# Altium project kursach.PrjPcb
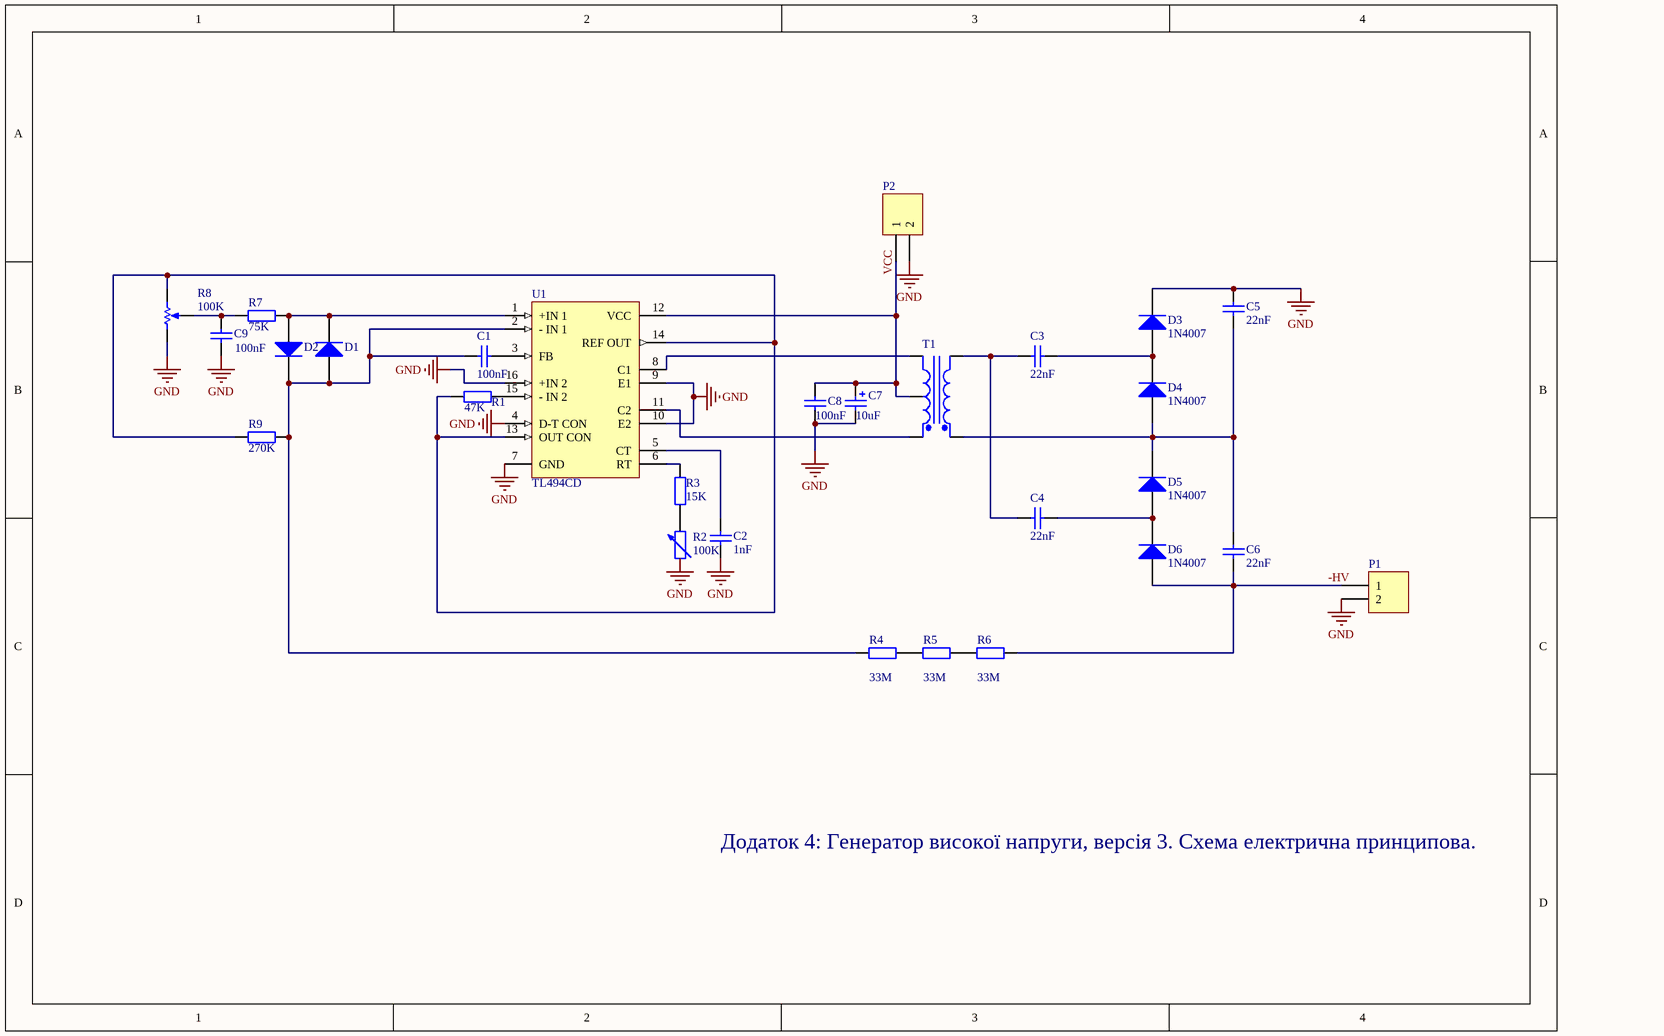
[diagram p0: dod1.SchDoc]
2 sheets, 58 parts. Net scope: global (net labels, ports and power ports of the same name join across sheets).
Sheets:
  dod1.SchDoc
  dod2.SchDoc

## Sheet dod1.SchDoc
size A4

### Parts
(Parts that share a designator on the sheet are numbered #1, #2 ... from top to bottom, then left to right.)
C1#1  value 100nF  [RAD-0.3]  (hidden comment: Cap)
C2#1  value 1nF  [RAD-0.3]  (hidden comment: Cap)
C3#1  value 22nF  [RAD-0.3]  (hidden comment: Cap)
C4#1  value 22nF  [RAD-0.3]  (hidden comment: Cap)
C5#1  value 22nF  [RAD-0.3]  (hidden comment: Cap)
C6#1  value 22nF  [RAD-0.3]  (hidden comment: Cap)
C7#1  value 10uF  [POLAR0.8]  (hidden comment: Cap Pol2)
C8  value 100nF  [RAD-0.3]  (hidden comment: Cap)
C9  value 100nF  [RAD-0.3]  (hidden comment: Cap)
D1#1  Diode 1N914  [DO-35]  (value not drawn)
D2#1  Diode 1N914  [DO-35]  (value not drawn)
D3#1  1N4007  [DO-41]
D4#1  1N4007  [DO-41]
D5  1N4007  [DO-41]
D6  1N4007  [DO-41]
P1#1  Header 2  [HDR1X2]  (value not drawn)
P2#1  Header 2  [HDR1X2]  (value not drawn)
R1#1  value 47K  [AXIAL-0.4]  (hidden comment: Res2)
R2#1  value 100K  [AXIAL-0.6]  (hidden comment: Res Adj2)
R3#1  value 15K  [AXIAL-0.4]  (hidden comment: Res2)
R4  value 33M  [AXIAL-0.4]  (hidden comment: Res2)
R5#1  value 33M  [AXIAL-0.4]  (hidden comment: Res2)
R6#1  value 33M  [AXIAL-0.4]  (hidden comment: Res2)
R7#1  value 75K  [AXIAL-0.4]  (hidden comment: Res2)
R8#1  value 100K  [VR5]  (hidden comment: RPot)
R9#1  value 270K  [AXIAL-0.4]  (hidden comment: Res2)
T1#1  Trans CT  [TRF_5]  (value not drawn)
U1#1  TL494CD  [D016_N]

### Nets
GND: C2#1.2 C5#1.2 C7#1.2 C8.2 C9.1 D3#1.2(K) P1#1.2 P2#1.2 R8#1.1(TOP) U1#1.4(D-T_CON) U1#1.7(GND) U1#1.9(E1) U1#1.10(E2) U1#1.16(+IN_2)
-HV: C6#1.1 D6.1(A) P1#1.1 R6#1.2
VCC: C7#1.1 C8.1 P2#1.1 T1#1.4(SecCT) U1#1.12(VCC)
NetC1#1_1: C1#1.1 D1#1.1(A) D2#1.2(K) R4.1 R9#1.2 U1#1.2(-_IN_1)
NetC1#1_2: C1#1.2 U1#1.3(FB)
NetC2#1_1: C2#1.1 U1#1.5(CT)
NetC3#1_1: C3#1.1 C4#1.1 T1#1.2(Pri-)
NetC3#1_2: C3#1.2 D3#1.1(A) D4#1.2(K)
NetC4#1_2: C4#1.2 D5.1(A) D6.2(K)
NetC5#1_1: C5#1.1 C6#1.2 D4#1.1(A) D5.2(K) T1#1.1(Pri+)
NetC9_2: C9.2 R7#1.1 R8#1.3(TAP)
NetD1#1_2: D1#1.2(K) D2#1.1(A) R7#1.2 U1#1.1(+IN_1)
NetR1#1_1: R1#1.1 R8#1.2(BOT) R9#1.1 U1#1.13(OUT_CON) U1#1.14(REF_OUT)
NetR1#1_2: R1#1.2 U1#1.15(-_IN_2)
NetR2#1_2: R2#1.2 R3#1.1
NetR3#1_2: R3#1.2 U1#1.6(RT)
NetR4_2: R4.2 R5#1.1
NetR5#1_2: R5#1.2 R6#1.1
NetT1#1_3: T1#1.3(Sec+) U1#1.11(C2)
NetT1#1_5: T1#1.5(Sec-) U1#1.8(C1)

Not connected (* = marked no-connect by the designer): R2#1 1

### Notes on the sheet
- Додаток 4: Генератор високої напруги, версія 3. Схема електрична принципова.
- Labels drawn without touching a wire or pin: GND

### Library data of the parts
C1#1 C2#1 C3#1 C4#1 C5#1 C6#1 C8 C9 = Cap: Capacitor; Published: 8-Jun-2000; LatestRevisionDate: 17-Jul-2002; LatestRevisionNote: Re-released for DXP Platform.; PackageReference: RAD-0.3; Publisher: Altium Limited; PackageDescription: Radial Cap, Thru-Hole; 2 Leads; 0.3 in Pin Spacing
C7#1 = Cap Pol2: Polarized Capacitor (Axial); Published: 8-Jun-2000; LatestRevisionDate: 17-Jul-2002; LatestRevisionNote: Re-released for DXP Platform.; PackageReference: POLAR0.8; Publisher: Altium Limited; PackageDescription: Polarized Capacitor; 2 Leads
D1#1 D2#1 = Diode 1N914: High Conductance Fast Diode; Published: 8-Jun-2000; LatestRevisionDate: 17-Jul-2002; LatestRevisionNote: Re-released for DXP Platform.; DatasheetVersion: 1997; PackageReference: DO-35; Publisher: Altium Limited; PackageDescription: Diode, Axial; Body 3.8 x 1.9 mm (LxDia. max), Lead Dia. 0.53 mm (max); Code_JEDEC: DO-204-AH; ComponentLink1Description: Manufacturer Link; ComponentLink1URL: http://www.fairchildsemi.com/; ComponentLink2Description: Datasheet; ComponentLink2URL: http://www.fairchildsemi.com/ds/1N%2F1N4448.pdf
D3#1 D4#1 D5 D6 = Diode 1N4007: 1 Amp General Purpose Rectifier; Published: 8-Jun-2000; LatestRevisionDate: 17-Jul-2002; LatestRevisionNote: Re-released for DXP Platform.; DatasheetVersion: 1998; PackageVersion: Aug-1999; PackageReference: DO-41; Publisher: Altium Limited; PackageDescription: Diode, Axial; Body 5.2 x 2.7 mm (LxDia. max), Lead Dia. 0.86 mm (max); Code_JEDEC: DO-204-AL; ComponentLink1Description: Manufacturer Link; ComponentLink1URL: http://www.fairchildsemi.com/; ComponentLink2Description: Datasheet; ComponentLink2URL: http://www.fairchildsemi.com/ds/1N%2F1N4001.pdf
P1#1 P2#1 = Header 2: Header, 2-Pin; LatestRevisionDate: 17-Jul-2002; LatestRevisionNote: Re-released for DXP Platform.; Publisher: Altium Limited
R1#1 R3#1 R4 R5#1 R6#1 R7#1 R9#1 = Res2: Resistor; Published: 8-Jun-2000; LatestRevisionDate: 17-Jul-2002; LatestRevisionNote: Re-released for DXP Platform.; PackageReference: AXIAL-0.4; Publisher: Altium Limited; PackageDescription: Axial Device, Thru-Hole; 2 Leads; 0.4 in Pin Spacing
R2#1 = Res Adj2: Variable Resistor; Set Position: 0.5; Published: 8-Jun-2000; LatestRevisionDate: 17-Jul-2002; LatestRevisionNote: Re-released for DXP Platform.; PackageReference: AXIAL-0.6; Publisher: Altium Limited; PackageDescription: Axial Device, Thru-Hole; 2 Leads; 0.6 in Pin Spacing
R8#1 = RPot: Potentiometer; Sim Note: Enter the Resistance value and the set point into parameter fields.; Set Position: 0.5; Published: 8-Jun-2000; LatestRevisionDate: 17-Jul-2002; LatestRevisionNote: Re-released for DXP Platform.; PackageReference: VR5; Publisher: Altium Limited; PackageDescription: Variable Resistor, Thru-Hole; 3 Leads
T1#1 = Trans CT: Center-Tapped Transformer (Coupled Inductor Model); Published: 8-Jun-2000; LatestRevisionDate: 17-Jul-2002; LatestRevisionNote: Re-released for DXP Platform.; PackageReference: TRF_5; Publisher: Altium Limited; PackageDescription: Transformer; 5 Leads
U1#1 = TL494CD: Pulse-Width-Modulation Control Circuit; Published: 15-Apr-2002; LatestRevisionDate: 13-Apr-2006; LatestRevisionNote: IPC-7351 Footprint Added.; DatasheetVersion: Oct-1988; PackageVersion: Jan-1998; PackageReference: D016; Publisher: Altium Limited; PackageDescription: 16-Pin Small Outline Integrated Circuit 1.27 mm Pitch; Code_IPC: SOIC127P600-16; ComponentLink1Description: Manufacturer Link; ComponentLink1URL: http://www.ti.com/

## Sheet dod2.SchDoc
size A4
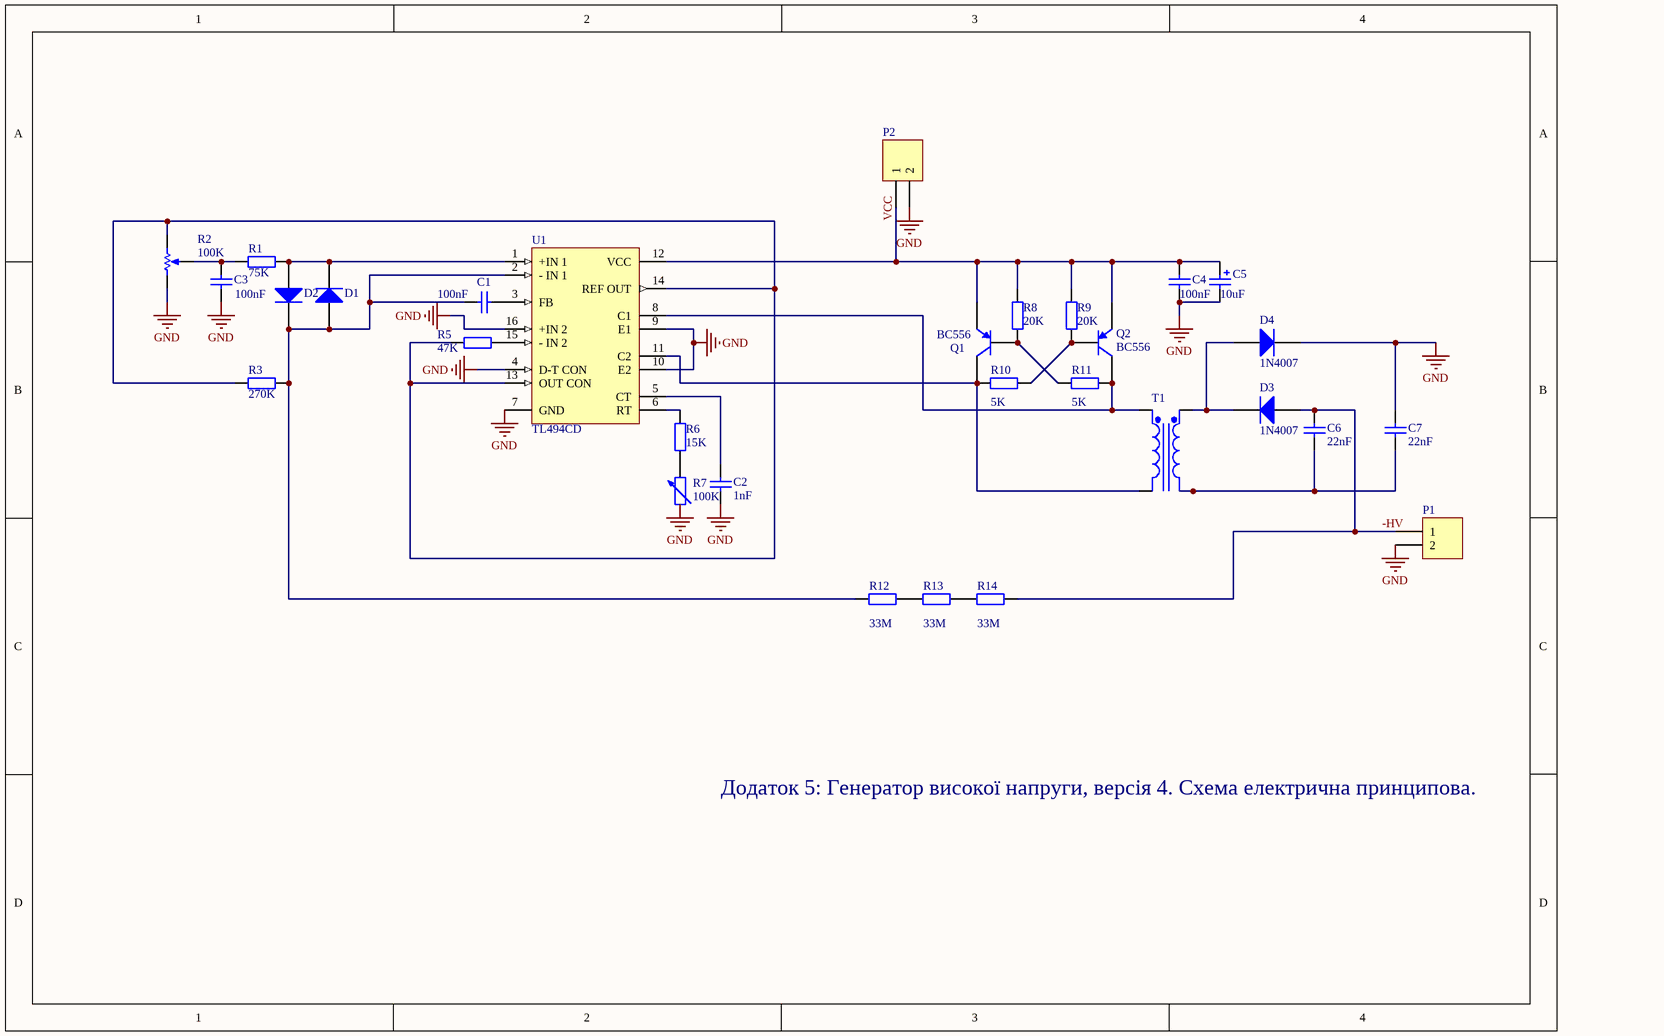
[diagram p1: dod2.SchDoc]

### Parts
(Parts that share a designator on the sheet are numbered #1, #2 ... from top to bottom, then left to right.)
C1#2  value 100nF  [RAD-0.3]  (hidden comment: Cap)
C2#2  value 1nF  [RAD-0.3]  (hidden comment: Cap)
C3#2  value 100nF  [RAD-0.3]  (hidden comment: Cap)
C4#2  value 100nF  [RAD-0.3]  (hidden comment: Cap)
C5#2  value 10uF  [POLAR0.8]  (hidden comment: Cap Pol2)
C6#2  value 22nF  [RAD-0.3]  (hidden comment: Cap)
C7#2  value 22nF  [RAD-0.3]  (hidden comment: Cap)
D1#2  Diode 1N914  [DO-35]  (value not drawn)
D2#2  Diode 1N914  [DO-35]  (value not drawn)
D3#2  1N4007  [DO-41]
D4#2  1N4007  [DO-41]
P1#2  Header 2  [HDR1X2]  (value not drawn)
P2#2  Header 2  [HDR1X2]  (value not drawn)
Q1  BC556  [TO-92A]
Q2  BC556  [TO-92A]
R1#2  value 75K  [AXIAL-0.4]  (hidden comment: Res2)
R2#2  value 100K  [VR5]  (hidden comment: RPot)
R3#2  value 270K  [AXIAL-0.4]  (hidden comment: Res2)
R5#2  value 47K  [AXIAL-0.4]  (hidden comment: Res2)
R6#2  value 15K  [AXIAL-0.4]  (hidden comment: Res2)
R7#2  value 100K  [AXIAL-0.6]  (hidden comment: Res Adj2)
R8#2  value 20K  [AXIAL-0.4]  (hidden comment: Res2)
R9#2  value 20K  [AXIAL-0.4]  (hidden comment: Res2)
R10  value 5K  [AXIAL-0.4]  (hidden comment: Res2)
R11  value 5K  [AXIAL-0.4]  (hidden comment: Res2)
R12  value 33M  [AXIAL-0.4]  (hidden comment: Res2)
R13  value 33M  [AXIAL-0.4]  (hidden comment: Res2)
R14  value 33M  [AXIAL-0.4]  (hidden comment: Res2)
T1#2  Trans Cupl  [TRF_4]  (value not drawn)
U1#2  TL494CD  [D016_N]

### Nets
GND: C2#2.2 C3#2.1 C4#2.2 C5#2.2 C7#2.2 D4#2.2(K) P1#2.2 P2#2.2 R2#2.1(TOP) U1#2.4(D-T_CON) U1#2.7(GND) U1#2.9(E1) U1#2.10(E2) U1#2.16(+IN_2)
-HV: C6#2.2 D3#2.1(A) P1#2.1 R14.2
VCC: C4#2.1 C5#2.1 P2#2.1 Q1.1(E) Q2.1(E) R8#2.2 R9#2.2 U1#2.12(VCC)
NetC1#2_1: C1#2.1 D1#2.1(A) D2#2.2(K) R3#2.2 R12.1 U1#2.2(-_IN_1)
NetC1#2_2: C1#2.2 U1#2.3(FB)
NetC2#2_1: C2#2.1 U1#2.5(CT)
NetC3#2_2: C3#2.2 R1#2.1 R2#2.3(TAP)
NetC6#2_1: C6#2.1 C7#2.1 T1#2.4(Sec-)
NetD1#2_2: D1#2.2(K) D2#2.1(A) R1#2.2 U1#2.1(+IN_1)
NetD3#2_2: D3#2.2(K) D4#2.1(A) T1#2.3(Sec+)
NetQ1_2: Q1.2(B) R8#2.1 R11.1
NetQ1_3: Q1.3(C) R10.1 T1#2.2(Pri-) U1#2.11(C2)
NetQ2_2: Q2.2(B) R9#2.1 R10.2
NetQ2_3: Q2.3(C) R11.2 T1#2.1(Pri+) U1#2.8(C1)
NetR2#2_2: R2#2.2(BOT) R3#2.1 R5#2.1 U1#2.13(OUT_CON) U1#2.14(REF_OUT)
NetR5#2_2: R5#2.2 U1#2.15(-_IN_2)
NetR6#2_1: R6#2.1 R7#2.2
NetR6#2_2: R6#2.2 U1#2.6(RT)
NetR12_2: R12.2 R13.1
NetR13_2: R13.2 R14.1

Not connected (* = marked no-connect by the designer): R7#2 1

### Notes on the sheet
- Додаток 5: Генератор високої напруги, версія 4. Схема електрична принципова.
- Labels drawn without touching a wire or pin: GND

### Library data of the parts
C1#2 C2#2 C3#2 C4#2 C6#2 C7#2 = Cap: Capacitor; Published: 8-Jun-2000; LatestRevisionDate: 17-Jul-2002; LatestRevisionNote: Re-released for DXP Platform.; PackageReference: RAD-0.3; Publisher: Altium Limited; PackageDescription: Radial Cap, Thru-Hole; 2 Leads; 0.3 in Pin Spacing
C5#2 = Cap Pol2: Polarized Capacitor (Axial); Published: 8-Jun-2000; LatestRevisionDate: 17-Jul-2002; LatestRevisionNote: Re-released for DXP Platform.; PackageReference: POLAR0.8; Publisher: Altium Limited; PackageDescription: Polarized Capacitor; 2 Leads
D1#2 D2#2 = Diode 1N914: High Conductance Fast Diode; Published: 8-Jun-2000; LatestRevisionDate: 17-Jul-2002; LatestRevisionNote: Re-released for DXP Platform.; DatasheetVersion: 1997; PackageReference: DO-35; Publisher: Altium Limited; PackageDescription: Diode, Axial; Body 3.8 x 1.9 mm (LxDia. max), Lead Dia. 0.53 mm (max); Code_JEDEC: DO-204-AH; ComponentLink1Description: Manufacturer Link; ComponentLink1URL: http://www.fairchildsemi.com/; ComponentLink2Description: Datasheet; ComponentLink2URL: http://www.fairchildsemi.com/ds/1N%2F1N4448.pdf
D3#2 D4#2 = Diode 1N4007: 1 Amp General Purpose Rectifier; Published: 8-Jun-2000; LatestRevisionDate: 17-Jul-2002; LatestRevisionNote: Re-released for DXP Platform.; DatasheetVersion: 1998; PackageVersion: Aug-1999; PackageReference: DO-41; Publisher: Altium Limited; PackageDescription: Diode, Axial; Body 5.2 x 2.7 mm (LxDia. max), Lead Dia. 0.86 mm (max); Code_JEDEC: DO-204-AL; ComponentLink1Description: Manufacturer Link; ComponentLink1URL: http://www.fairchildsemi.com/; ComponentLink2Description: Datasheet; ComponentLink2URL: http://www.fairchildsemi.com/ds/1N%2F1N4001.pdf
P1#2 P2#2 = Header 2: Header, 2-Pin; LatestRevisionDate: 17-Jul-2002; LatestRevisionNote: Re-released for DXP Platform.; Publisher: Altium Limited
Q1 Q2 = 2N3906: PNP General Purpose Amplifier; Published: 8-Jun-2000; LatestRevisionDate: 15-Jan-2003; LatestRevisionNote: PCB Footprint 'BCY-W3/D4.7' replaced; DatasheetVersion: 1997; PackageVersion: Sep-1998; PackageReference: TO-92A; Publisher: Altium Limited; PackageDescription: TO, Flat Index; 3 In-Line, Axial Leads; Body Dia. 4.5mm; Leads 0.51 x 0.48 mm (max); ComponentLink1Description: Manufacturer Link; ComponentLink1URL: http://www.fairchildsemi.com/; ComponentLink2Description: Datasheet; ComponentLink2URL: http://www.fairchildsemi.com/ds/2N%2F2N3906.pdf
R1#2 R3#2 R5#2 R6#2 R8#2 R9#2 R10-R14 = Res2: Resistor; Published: 8-Jun-2000; LatestRevisionDate: 17-Jul-2002; LatestRevisionNote: Re-released for DXP Platform.; PackageReference: AXIAL-0.4; Publisher: Altium Limited; PackageDescription: Axial Device, Thru-Hole; 2 Leads; 0.4 in Pin Spacing
R2#2 = RPot: as R8#1 on sheet dod1; Published: 8-Jun-2000; LatestRevisionDate: 17-Jul-2002; LatestRevisionNote: Re-released for DXP Platform.; PackageReference: VR5; Publisher: Altium Limited; PackageDescription: Variable Resistor, Thru-Hole; 3 Leads
R7#2 = Res Adj2: Variable Resistor; Set Position: 0.5; Published: 8-Jun-2000; LatestRevisionDate: 17-Jul-2002; LatestRevisionNote: Re-released for DXP Platform.; PackageReference: AXIAL-0.6; Publisher: Altium Limited; PackageDescription: Axial Device, Thru-Hole; 2 Leads; 0.6 in Pin Spacing
T1#2 = Trans Cupl: Transformer (Coupled Inductor Model); Published: 8-Jun-2000; LatestRevisionDate: 17-Jul-2002; LatestRevisionNote: Re-released for DXP Platform.; PackageReference: TRF_4; Publisher: Altium Limited; PackageDescription: Transformer; 4 Leads
U1#2 = TL494CD: Pulse-Width-Modulation Control Circuit; Published: 15-Apr-2002; LatestRevisionDate: 13-Apr-2006; LatestRevisionNote: IPC-7351 Footprint Added.; DatasheetVersion: Oct-1988; PackageVersion: Jan-1998; PackageReference: D016; Publisher: Altium Limited; PackageDescription: 16-Pin Small Outline Integrated Circuit 1.27 mm Pitch; Code_IPC: SOIC127P600-16; ComponentLink1Description: Manufacturer Link; ComponentLink1URL: http://www.ti.com/

## Nets that join several sheets
GND: dod1 (14 pins), dod2 (14 pins)
-HV: dod1 (C6#1.1 D6.1 P1#1.1 R6#1.2), dod2 (C6#2.2 D3#2.1 P1#2.1 R14.2)
VCC: dod1 (5 pins), dod2 (8 pins)